# Altium schematic sheet Cooling_Control_1.SchDoc
size A4; SheetNumber: 7; SheetTotal: 7
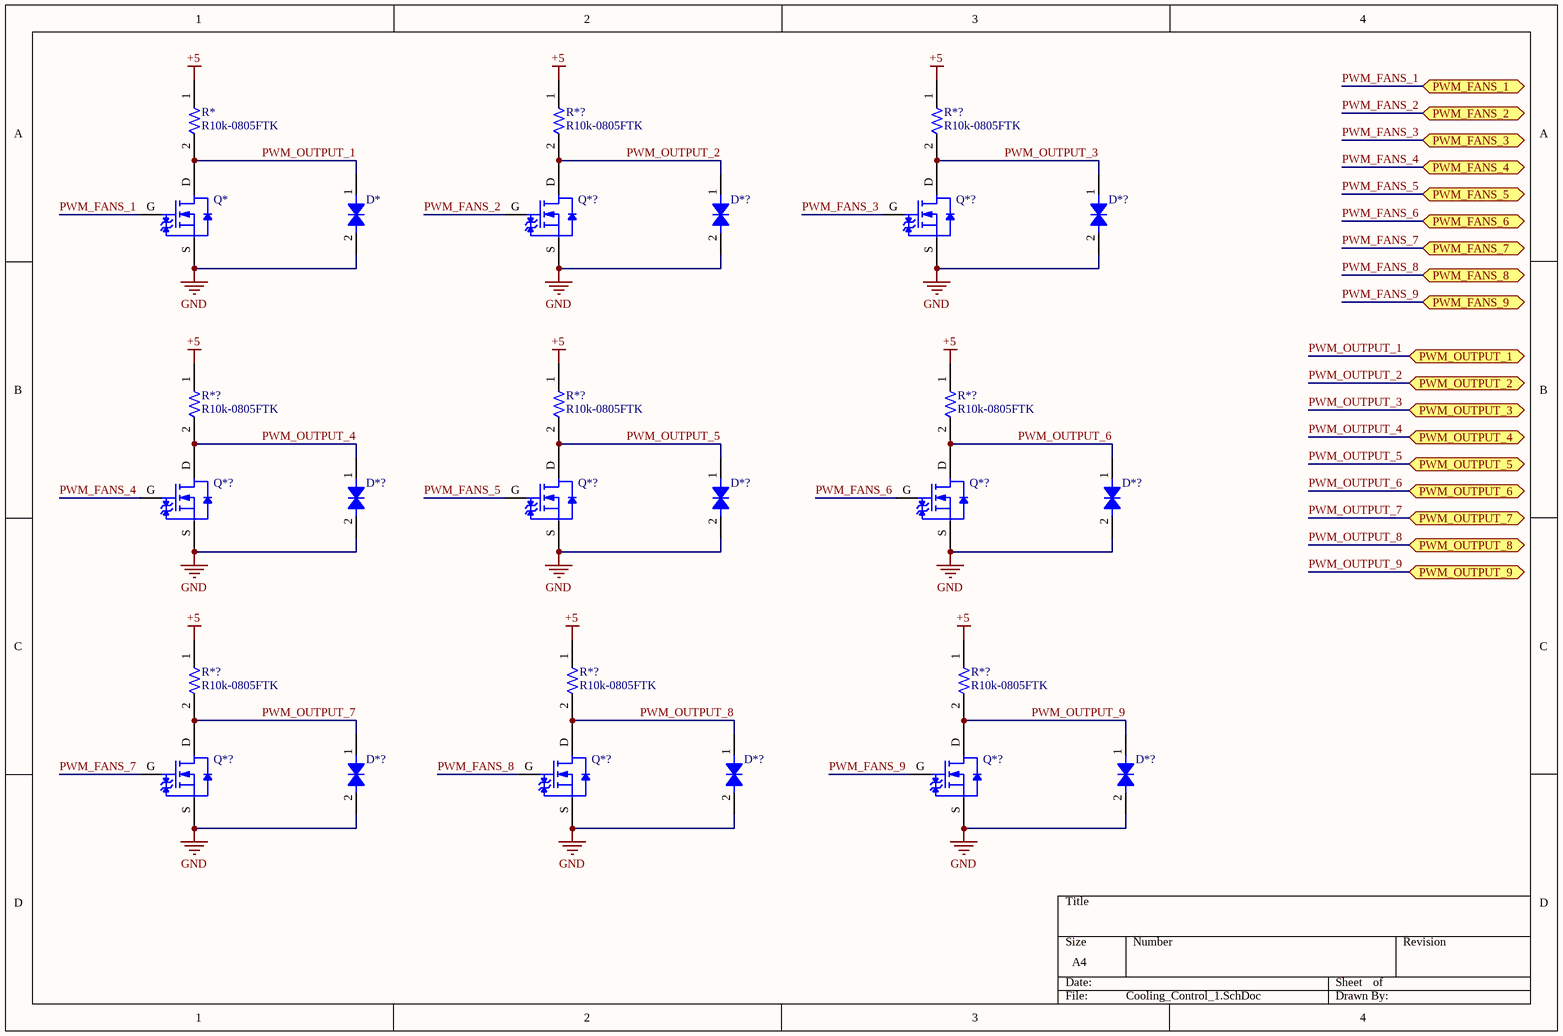
[diagram p0: Cooling_Control_1.SchDoc]

## Parts
(Parts that share a designator on the sheet are numbered #1, #2 ... from top to bottom, then left to right.)
D*  DTVS-13V-DO-214AC  [DTVS-DO-214AC]  (value not drawn)
D*?#1  DTVS-13V-DO-214AC  [DTVS-DO-214AC]  (value not drawn)
D*?#2  DTVS-13V-DO-214AC  [DTVS-DO-214AC]  (value not drawn)
D*?#3  DTVS-13V-DO-214AC  [DTVS-DO-214AC]  (value not drawn)
D*?#4  DTVS-13V-DO-214AC  [DTVS-DO-214AC]  (value not drawn)
D*?#5  DTVS-13V-DO-214AC  [DTVS-DO-214AC]  (value not drawn)
D*?#6  DTVS-13V-DO-214AC  [DTVS-DO-214AC]  (value not drawn)
D*?#7  DTVS-13V-DO-214AC  [DTVS-DO-214AC]  (value not drawn)
D*?#8  DTVS-13V-DO-214AC  [DTVS-DO-214AC]  (value not drawn)
Q*  SQ2318CES-T1_GE3  [SOT95P245X110-3N]  (value not drawn)
Q*?#1  SQ2318CES-T1_GE3  [SOT95P245X110-3N]  (value not drawn)
Q*?#2  SQ2318CES-T1_GE3  [SOT95P245X110-3N]  (value not drawn)
Q*?#3  SQ2318CES-T1_GE3  [SOT95P245X110-3N]  (value not drawn)
Q*?#4  SQ2318CES-T1_GE3  [SOT95P245X110-3N]  (value not drawn)
Q*?#5  SQ2318CES-T1_GE3  [SOT95P245X110-3N]  (value not drawn)
Q*?#6  SQ2318CES-T1_GE3  [SOT95P245X110-3N]  (value not drawn)
Q*?#7  SQ2318CES-T1_GE3  [SOT95P245X110-3N]  (value not drawn)
Q*?#8  SQ2318CES-T1_GE3  [SOT95P245X110-3N]  (value not drawn)
R*  R10k-0805FTK  [R0805FTK]
R*?#1  R10k-0805FTK  [R0805FTK]
R*?#2  R10k-0805FTK  [R0805FTK]
R*?#3  R10k-0805FTK  [R0805FTK]
R*?#4  R10k-0805FTK  [R0805FTK]
R*?#5  R10k-0805FTK  [R0805FTK]
R*?#6  R10k-0805FTK  [R0805FTK]
R*?#7  R10k-0805FTK  [R0805FTK]
R*?#8  R10k-0805FTK  [R0805FTK]

## Ports
PWM_FANS_1 (bidir), PWM_FANS_2 (bidir), PWM_FANS_3 (bidir), PWM_FANS_4 (bidir), PWM_FANS_5 (bidir), PWM_FANS_6 (bidir), PWM_FANS_7 (bidir), PWM_FANS_8 (bidir), PWM_FANS_9 (bidir), PWM_OUTPUT_1 (bidir), PWM_OUTPUT_2 (bidir), PWM_OUTPUT_3 (bidir), PWM_OUTPUT_4 (bidir), PWM_OUTPUT_5 (bidir), PWM_OUTPUT_6 (bidir), PWM_OUTPUT_7 (bidir), PWM_OUTPUT_8 (bidir), PWM_OUTPUT_9 (bidir)

## Nets
+5: R*.1 R*?#1.1 R*?#2.1 R*?#3.1 R*?#4.1 R*?#5.1 R*?#6.1 R*?#7.1 R*?#8.1
GND: D*.2 D*?#1.2 D*?#2.2 D*?#3.2 D*?#4.2 D*?#5.2 D*?#6.2 D*?#7.2 D*?#8.2 Q*.S Q*?#1.S Q*?#2.S Q*?#3.S Q*?#4.S Q*?#5.S Q*?#6.S Q*?#7.S Q*?#8.S
PWM_FANS_1: Q*.G ; port PWM_FANS_1
PWM_FANS_2: Q*?#1.G ; port PWM_FANS_2
PWM_FANS_3: Q*?#2.G ; port PWM_FANS_3
PWM_FANS_4: Q*?#3.G ; port PWM_FANS_4
PWM_FANS_5: Q*?#4.G ; port PWM_FANS_5
PWM_FANS_6: Q*?#5.G ; port PWM_FANS_6
PWM_FANS_7: Q*?#6.G ; port PWM_FANS_7
PWM_FANS_8: Q*?#7.G ; port PWM_FANS_8
PWM_FANS_9: Q*?#8.G ; port PWM_FANS_9
PWM_OUTPUT_1: D*.1 Q*.D R*.2 ; port PWM_OUTPUT_1
PWM_OUTPUT_2: D*?#1.1 Q*?#1.D R*?#1.2 ; port PWM_OUTPUT_2
PWM_OUTPUT_3: D*?#2.1 Q*?#2.D R*?#2.2 ; port PWM_OUTPUT_3
PWM_OUTPUT_4: D*?#3.1 Q*?#3.D R*?#3.2 ; port PWM_OUTPUT_4
PWM_OUTPUT_5: D*?#4.1 Q*?#4.D R*?#4.2 ; port PWM_OUTPUT_5
PWM_OUTPUT_6: D*?#5.1 Q*?#5.D R*?#5.2 ; port PWM_OUTPUT_6
PWM_OUTPUT_7: D*?#6.1 Q*?#6.D R*?#6.2 ; port PWM_OUTPUT_7
PWM_OUTPUT_8: D*?#7.1 Q*?#7.D R*?#7.2 ; port PWM_OUTPUT_8
PWM_OUTPUT_9: D*?#8.1 Q*?#8.D R*?#8.2 ; port PWM_OUTPUT_9

## Library data of the parts
D* D*?#1-D*?#8 = CMP-00155-1: Tvs Diode, 400W, 13V, Bidir, DO-214AC; Manufacturer Part Number: 824501131; Manufacturer: Wurth Electronics; Peak Pulse Current: 18.6A; Power Line Protection: No; .Creator: DO; Forward Voltage: 15.15V; Polarity: Bidirectional; Number of Bidirectional Channels: 1; Clamping Voltage: 21.5V; Max Operating Temperature: 150°C; Category: TVS Diodes; Stock 1: 1000; RoHS: Yes; ComponentLink3Description: Where buy it; Source: Filter components.SchLib; Design Item ID: DTVS-13V-DO-214AC; REACH SVHC: Unknown; Min Operating Temperature: -65°C; Resistor Type: Zener; ComponentLink2Description: http://www.farnell.com/datasheets/2036399.pdf?src-supplier=Element14; Peak Pulse Power: 400W; ComponentLink1URL: https://katalog.we-online.de/pbs/datasheet/824501131.pdf?src-supplier=Digi-Key; Packaging: Cut Tape; ComponentLink2URL: http://www.farnell.com/datasheets/2036399.pdf?src-supplier=Element14; ComponentLink3URL: https://www.we-online.com/catalog/en/WE-TVSP?sq=824501131#824501131; RoHS Compliant: Yes; Reverse Standoff Voltage: 13V; Mount: Surface Mount; Min Breakdown Voltage: 15.15V; ComponentLink1Description: https://katalog.we-online.de/pbs/datasheet/824501131.pdf?src-supplier=Digi-Key; Pricing 1: 1=0,27000 (USD); Pins: 2
Q* Q*?#1-Q*?#8 = CMP-013-00002-1: Mosfet, N-channel, 40V, 7A, SOT-23 Rohs Compliant: Yes
R* R*?#1-R*?#8 = CMP-00085-1: BOURNS         CR0805-JW-103ELF            Surface Mount Chip Resistor, Thick Film, CR Series, 10 kohm, 125 mW,  5%, 150 V; .Creator: DR; Power Rating: 125mW; Voltage Rating (DC): 100V; Voltage Rating: 150V; Temperature Coefficient: 200ppm/°C; Value: 10k; ComponentLink6URL: https://datasheet.ciiva.com/16783/70154685-16783482.pdf?src-supplier=Allied+Electronics; Manufacturer 1: Bourns; Package Quantity: 1; ComponentLink10URL: https://datasheet.ciiva.com/7985/1856384-7985869.pdf?src-supplier=Element14; Technology: THICK FILM; Source: Passives.SchLib; RoHS Compliant: Yes; ComponentLink10Description: https://datasheet.ciiva.com/7985/1856384-7985869.pdf?src-supplier=Element14; ComponentLink1URL: https://datasheet.ciiva.com/11821/0900766b80fcdb72-11821135.pdf?src-supplier=RSComponents; ComponentLink7Description: https://datasheet.ciiva.com/5548/chpreztr-5548491.pdf?src-supplier=Mouser; Radiation Hardening: No; Design Item ID: R10k-0805FTK; ComponentLink4Description: https://datasheet.ciiva.com/7986/691949-7986187.pdf?src-supplier=Element14; Pins: 2; ComponentLink9URL: https://datasheet.ciiva.com/6559/chpreztr-6559901.pdf?src-supplier=Digi-Key; Resistor Type: Thick Film; ComponentLink4URL: https://datasheet.ciiva.com/7986/691949-7986187.pdf?src-supplier=Element14; Contact Plating: Tin; Case Code (Metric): 2012; Military Standard: Not; Depth: 1.25mm; Case/Package: 0805; Packaging: Tape and Reel; ComponentLink9Description: https://datasheet.ciiva.com/6559/chpreztr-6559901.pdf?src-supplier=Digi-Key; Construction: Rectangular; Pricing 1: 1=0,05790, 10=0,01540, 25=0,01340, 100=0,00340 (USD); ComponentLink7URL: https://datasheet.ciiva.com/5548/chpreztr-5548491.pdf?src-supplier=Mouser; Category: Chip SMD Resistors; Length: 2mm; Max Operating Temperature: 155°C; Resistance Tolerance: 5%; Manufacturer Part Number 1: CR0805-JW-103ELF; Height: 0.5mm; ComponentLink2URL: https://datasheet.ciiva.com/9122/chpreztr-9122374.pdf?src-supplier=Avnet; Thickness: 508um; Max Power Dissipation: 125mW; ComponentLink8Description: https://datasheet.ciiva.com/6559/chpreztr-6559900.pdf?src-supplier=Digi-Key; REACH SVHC: No SVHC; ComponentLink8URL: https://datasheet.ciiva.com/6559/chpreztr-6559900.pdf?src-supplier=Digi-Key; ComponentLink5URL: https://datasheet.ciiva.com/30065/159chpreztr-30065976.pdf?src-supplier=Onlinecomponents.com; Width: 1.25mm; ComponentLink11URL: https://datasheet.ciiva.com/48692/001055517-da-01-en-smd-wid-cr0805-jw-103elf-10k-ohm-1-8w-48692118.pdf?src-supplier=Conrad; ComponentLink3Description: https://datasheet.ciiva.com/22693/1902866-22693254.pdf?src-supplier=Element14; ComponentLink11Description: https://datasheet.ciiva.com/48692/001055517-da-01-en-smd-wid-cr0805-jw-103elf-10k-ohm-1-8w-48692118.pdf?src-supplier=Conrad; ComponentLink1Description: https://datasheet.ciiva.com/11821/0900766b80fcdb72-11821135.pdf?src-supplier=RSComponents; ComponentLink2Description: https://datasheet.ciiva.com/9122/chpreztr-9122374.pdf?src-supplier=Avnet; Stock 1: 57566; Min Operating Temperature: -55°C; Series: CR0805; Number of Terminations: 2; Termination: SMD/SMT; Tolerance: 5%; Mount: Surface Mount; ComponentLink6Description: https://datasheet.ciiva.com/16783/70154685-16783482.pdf?src-supplier=Allied+Electronics; ComponentLink5Description: https://datasheet.ciiva.com/30065/159chpreztr-30065976.pdf?src-supplier=Onlinecomponents.com; RoHS: Yes; Features: Moisture Resistant; ComponentLink3URL: https://datasheet.ciiva.com/22693/1902866-22693254.pdf?src-supplier=Element14